# Altium schematic sheet BMS_REV3.SchDoc
size B; Organization: Altium Limited; Address1: L3, 12a Rodborough Rd; Address2: Frenchs Forest; Address3: NSW; Address4: Australia 2086
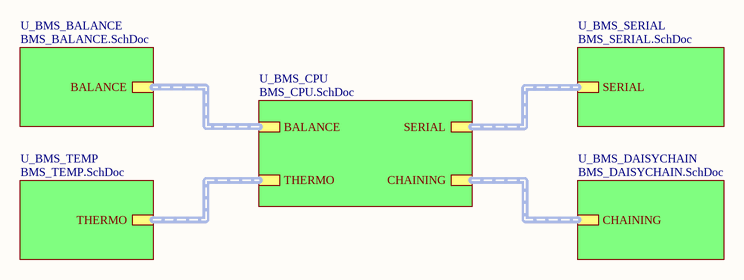
[diagram p0: BMS_REV3.SchDoc]

## Sub-sheets
U_BMS_BALANCE = BMS_BALANCE.SchDoc: BALANCE (harness BALANCE)
U_BMS_CPU = BMS_CPU.SchDoc: SERIAL (harness SERIAL), CHAINING (harness CHAINING), THERMO (harness THERMO), BALANCE (harness BALANCE)
U_BMS_DAISYCHAIN = BMS_DAISYCHAIN.SchDoc: CHAINING (harness CHAINING)
U_BMS_SERIAL = BMS_SERIAL.SchDoc: SERIAL (harness SERIAL)
U_BMS_TEMP = BMS_TEMP.SchDoc: THERMO (harness THERMO)

## Buses and harness runs
harness sheet U_BMS_BALANCE/BALANCE = sheet U_BMS_CPU/BALANCE
harness sheet U_BMS_CPU/CHAINING = sheet U_BMS_DAISYCHAIN/CHAINING
harness sheet U_BMS_CPU/SERIAL = sheet U_BMS_SERIAL/SERIAL
harness sheet U_BMS_CPU/THERMO = sheet U_BMS_TEMP/THERMO

## Notes on the sheet
- Title
- Size:
- Date:
- Tabloid
- Number:
- Time:
- Revision:
- Sheet
- of
- File: